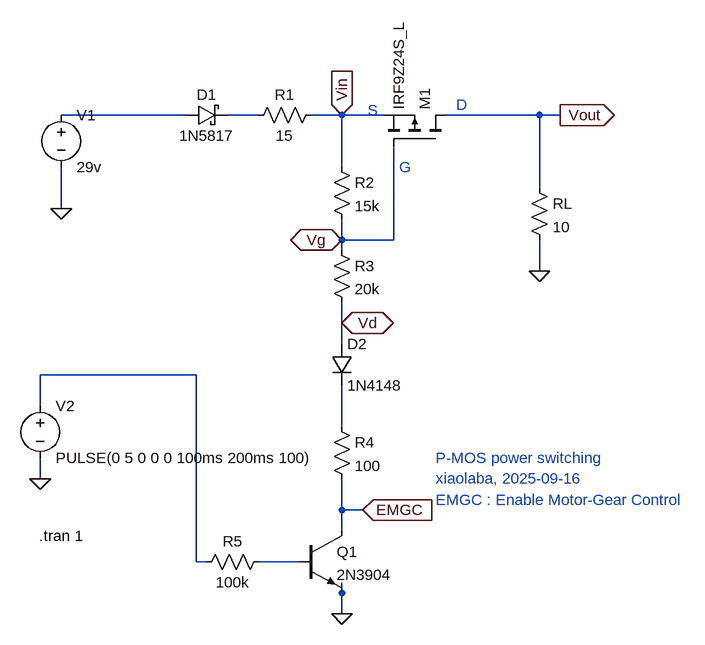
[diagram p0: schematic PMOS_power_switch.asc]
PMOS_power_switch.asc, the LTspice schematic file:
Version 4
SHEET 1 880 944
WIRE -384 48 -576 48
WIRE -272 48 -320 48
WIRE -144 48 -192 48
WIRE -80 48 -144 48
WIRE 160 48 16 48
WIRE 192 48 160 48
WIRE -144 128 -144 48
WIRE 160 160 160 48
WIRE -576 192 -576 128
WIRE -144 240 -144 208
WIRE -64 240 -64 96
WIRE -64 240 -144 240
WIRE -144 256 -144 240
WIRE 160 288 160 240
WIRE -144 368 -144 336
WIRE -144 400 -144 368
WIRE -368 448 -608 448
WIRE -608 496 -608 448
WIRE -144 528 -144 464
WIRE -608 608 -608 576
WIRE -144 656 -144 608
WIRE -112 656 -144 656
WIRE -144 688 -144 656
WIRE -368 736 -368 448
WIRE -352 736 -368 736
WIRE -208 736 -272 736
WIRE -144 784 -144 768
WIRE -144 816 -144 784
FLAG -576 192 0
FLAG -144 816 0
FLAG 192 48 Vout
IOPIN 192 48 Out
FLAG 160 288 0
FLAG -144 240 Vg
IOPIN -144 240 BiDir
FLAG -144 368 Vd
IOPIN -144 368 BiDir
FLAG -144 48 Vin
IOPIN -144 48 In
FLAG -608 608 0
FLAG -112 656 EMGC
IOPIN -112 656 In
SYMBOL schottky -384 64 R270
WINDOW 0 32 32 VTop 2
WINDOW 3 0 32 VBottom 2
SYMATTR InstName D1
SYMATTR Value 1N5817
SYMATTR Description Diode
SYMATTR Type diode
SYMBOL res -176 32 R90
WINDOW 0 0 56 VBottom 2
WINDOW 3 32 56 VTop 2
SYMATTR InstName R1
SYMATTR Value 15
SYMBOL res -160 112 R0
SYMATTR InstName R2
SYMATTR Value 15k
SYMBOL res -160 240 R0
SYMATTR InstName R3
SYMATTR Value 20k
SYMBOL diode -160 400 R0
SYMATTR InstName D2
SYMATTR Value 1N4148
SYMBOL res -160 512 R0
SYMATTR InstName R4
SYMATTR Value 100
SYMBOL voltage -576 32 R0
WINDOW 123 0 0 Left 0
WINDOW 39 0 0 Left 0
SYMATTR InstName V1
SYMATTR Value 29v
SYMBOL res 144 144 R0
SYMATTR InstName RL
SYMATTR Value 10
SYMBOL pmos 16 96 M270
SYMATTR InstName M1
SYMATTR Value IRF9Z24S_L
SYMBOL voltage -608 480 R0
WINDOW 123 0 0 Left 0
WINDOW 39 0 0 Left 0
SYMATTR InstName V2
SYMATTR Value PULSE(0 5 0 0 0 100ms 200ms 100)
SYMBOL npn -208 688 R0
SYMATTR InstName Q1
SYMATTR Value 2N3904
SYMBOL res -256 720 R90
WINDOW 0 0 56 VBottom 2
WINDOW 3 32 56 VTop 2
SYMATTR InstName R5
SYMATTR Value 100k
TEXT -610 696 Left 2 !.tran 1
TEXT 0 576 Left 2 ;P-MOS power switching\nxiaolaba, 2025-09-16
TEXT 32 32 Left 2 ;D
TEXT -56 128 Left 2 ;G
TEXT -104 40 Left 2 ;S
TEXT 0 640 Left 2 ;EMGC : Enable Motor-Gear Control

The netlist it stands for:
* PMOS_power_switch.asc
D1 N001 N002 1N5817
R1 Vin N002 15
R2 Vin Vg 15k
R3 Vg Vd 20k
D2 Vd N004 1N4148
R4 N004 EMGC 100
V1 N001 0 29v
RL Vout 0 10
M1 Vout Vg Vin Vin IRF9Z24S_L
V2 N003 0 PULSE(0 5 0 0 0 100ms 200ms 100)
Q1 EMGC N005 0 0 2N3904
R5 N005 N003 100k
.model D D
.lib standard.dio
.model NPN NPN
.model PNP PNP
.lib standard.bjt
.model NMOS NMOS
.model PMOS PMOS
.lib standard.mos
.tran 1
* P-MOS power switching
* xiaolaba, 2025-09-16
* D
* G
* S
* EMGC : Enable Motor-Gear Control
.backanno
.end